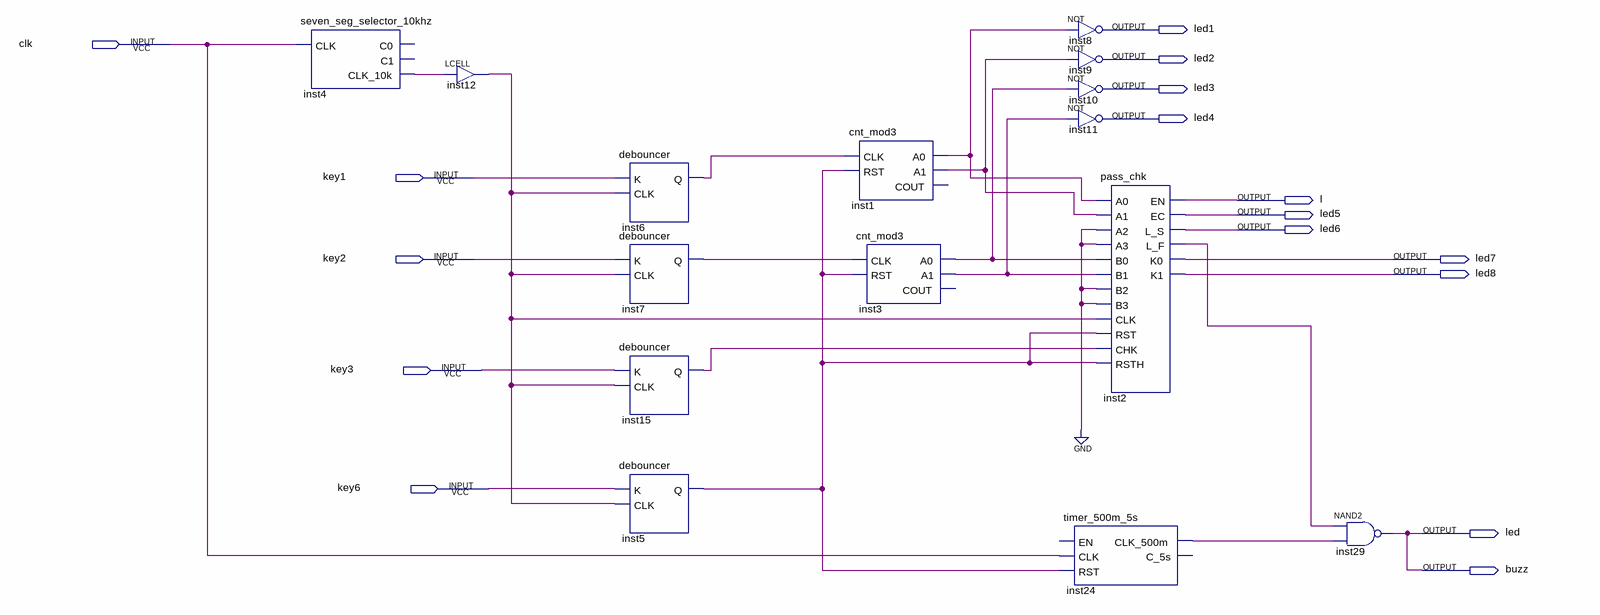
[diagram p0: schematic sheet]
// Quartus schematic test2.bdf as structural Verilog: 15 symbols, 16 pins
module test2 (
  input  clk,
  input  key1,
  input  key2,
  input  key3,
  input  key6,
  output led1,
  output led2,
  output led3,
  output led4,
  output l,
  output led5,
  output led6,
  output led7,
  output led8,
  output led,
  output buzz
);

  wire inst1_a0, inst1_a1, inst2_l_f, inst3_a0, inst3_a1, inst4_clk_10k, inst5_q, inst6_q, inst7_q,
       inst12_out, inst15_q, inst24_clk_500m;

  seven_seg_selector_10khz inst4 (.CLK(clk), .CLK_10k(inst4_clk_10k));  // open: C0, C1
  LCELL inst12 (.IN(inst4_clk_10k), .OUT(inst12_out));
  debouncer inst6 (.K(key1), .CLK(inst12_out), .Q(inst6_q));
  debouncer inst7 (.K(key2), .CLK(inst12_out), .Q(inst7_q));
  debouncer inst15 (.K(key3), .CLK(inst12_out), .Q(inst15_q));
  debouncer inst5 (.K(key6), .CLK(inst12_out), .Q(inst5_q));
  cnt_mod3 inst1 (.CLK(inst6_q), .RST(inst5_q), .A0(inst1_a0), .A1(inst1_a1));  // open: COUT
  cnt_mod3 inst3 (.CLK(inst7_q), .RST(inst5_q), .A0(inst3_a0), .A1(inst3_a1));  // open: COUT
  timer_500m_5s inst24 (.CLK(clk), .RST(inst5_q), .CLK_500m(inst24_clk_500m));  // open: EN, C_5s
  not inst8 (led1, inst1_a0);
  not inst9 (led2, inst1_a1);
  not inst10 (led3, inst3_a0);
  not inst11 (led4, inst3_a1);
  pass_chk inst2 (
    .A0(inst1_a0), .A1(inst1_a1), .A2(1'b0), .A3(1'b0), .B0(inst3_a0), .B1(inst3_a1), .B2(1'b0), .B3(1'b0),
    .CLK(inst12_out), .RST(inst5_q), .CHK(inst15_q), .RSTH(inst5_q), .EN(l), .EC(led5), .L_S(led6),
    .L_F(inst2_l_f), .K0(led7), .K1(led8));
  nand inst29 (buzz, inst2_l_f, inst24_clk_500m);

  assign led = buzz;
endmodule
